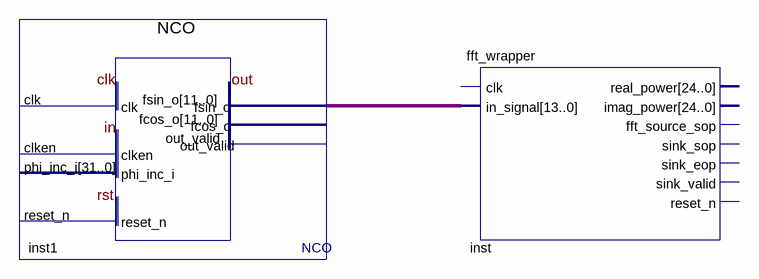
[diagram p0: schematic sheet]
// Quartus schematic block.bdf as structural Verilog: 2 symbols, 0 pins
module block (
);

  wire [13:0] inst1_fsin_o;

  NCO inst1 (.fsin_o(inst1_fsin_o));  // open: clk, clken, phi_inc_i, reset_n, fcos_o, out_valid
  fft_wrapper inst (.in_signal(inst1_fsin_o));  // open: clk, real_power, imag_power, fft_source_sop, sink_sop, sink_eop, sink_valid, reset_n
endmodule
